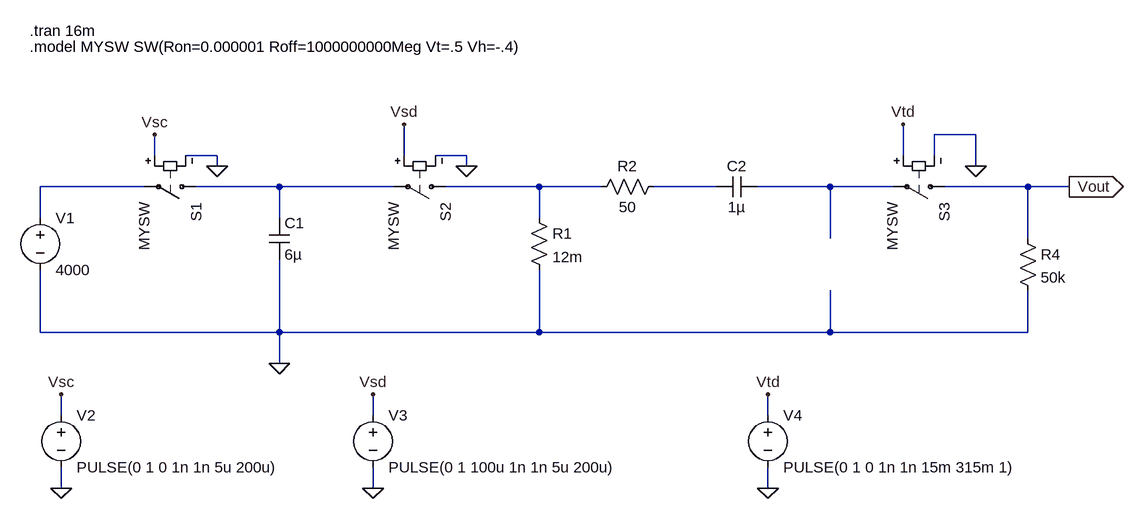
[diagram p0: schematic Draft1.asc]
Draft1.asc, the LTspice schematic file:
Version 4
SHEET 1 1632 680
WIRE 1376 0 1312 0
WIRE 112 32 112 0
WIRE 208 32 160 32
WIRE 496 32 496 -16
WIRE 592 32 544 32
WIRE 1264 32 1264 -16
WIRE 1312 32 1312 0
WIRE 208 48 208 32
WIRE 592 48 592 32
WIRE 1376 48 1376 0
WIRE 96 80 -64 80
WIRE 304 80 176 80
WIRE 480 80 304 80
WIRE 704 80 560 80
WIRE 800 80 704 80
WIRE 976 80 880 80
WIRE 1152 80 1040 80
WIRE 1248 80 1152 80
WIRE 1456 80 1328 80
WIRE 1520 80 1456 80
WIRE -64 128 -64 80
WIRE 304 128 304 80
WIRE 704 128 704 80
WIRE 1152 160 1152 80
WIRE 1456 160 1456 80
WIRE -64 304 -64 208
WIRE 304 304 304 192
WIRE 304 304 -64 304
WIRE 704 304 704 208
WIRE 704 304 304 304
WIRE 1152 304 1152 240
WIRE 1152 304 704 304
WIRE 1456 304 1456 240
WIRE 1456 304 1152 304
WIRE 304 352 304 304
WIRE -32 432 -32 400
WIRE 448 432 448 400
WIRE 1056 432 1056 400
WIRE -32 544 -32 512
WIRE 448 544 448 512
WIRE 1056 544 1056 512
FLAG 112 0 Vsc
FLAG 496 -16 Vsd
FLAG 304 352 0
FLAG 208 48 0
FLAG 592 48 0
FLAG -32 400 Vsc
FLAG 448 400 Vsd
FLAG -32 544 0
FLAG 448 544 0
FLAG 1264 -16 Vtd
FLAG 1376 48 0
FLAG 1520 80 Vout
IOPIN 1520 80 Out
FLAG 1056 400 Vtd
FLAG 1056 544 0
SYMBOL voltage -64 112 R0
WINDOW 123 0 0 Left 0
WINDOW 39 0 0 Left 0
SYMATTR InstName V1
SYMATTR Value 4000
SYMBOL sw 192 80 R90
SYMATTR InstName S1
SYMATTR Value MYSW
SYMBOL sw 576 80 R90
SYMATTR InstName S2
SYMATTR Value MYSW
SYMBOL cap 288 128 R0
SYMATTR InstName C1
SYMATTR Value 6µ
SYMBOL res 688 112 R0
SYMATTR InstName R1
SYMATTR Value 12m
SYMBOL res 784 96 R270
WINDOW 0 32 56 VTop 2
WINDOW 3 0 56 VBottom 2
SYMATTR InstName R2
SYMATTR Value 50
SYMBOL cap 976 96 R270
WINDOW 0 32 32 VTop 2
WINDOW 3 0 32 VBottom 2
SYMATTR InstName C2
SYMATTR Value 1µ
SYMBOL voltage -32 416 R0
WINDOW 123 0 0 Left 0
WINDOW 39 0 0 Left 0
SYMATTR InstName V2
SYMATTR Value PULSE(0 1 0 1n 1n 5u 200u)
SYMBOL voltage 448 416 R0
WINDOW 123 0 0 Left 0
WINDOW 39 0 0 Left 0
SYMATTR InstName V3
SYMATTR Value PULSE(0 1 100u 1n 1n 5u 200u)
SYMBOL sw 1344 80 R90
SYMATTR InstName S3
SYMATTR Value MYSW
SYMBOL res 1440 144 R0
SYMATTR InstName R4
SYMATTR Value 50k
SYMBOL voltage 1056 416 R0
WINDOW 123 0 0 Left 0
WINDOW 39 0 0 Left 0
SYMATTR InstName V4
SYMATTR Value PULSE(0 1 0 1n 1n 15m 315m 1)
TEXT -80 -160 Left 2 !.tran 16m
TEXT -80 -136 Left 2 !.model MYSW SW(Ron=0.000001 Roff=1000000000Meg Vt=.5 Vh=-.4)

The netlist it stands for:
* Draft1.asc
V1 N001 0 4000
S1 N002 N001 Vsc 0 MYSW
S2 N003 N002 Vsd 0 MYSW
C1 N002 0 6µ
R1 N003 0 12m
R2 N003 N004 50
C2 N004 N005 1µ
V2 Vsc 0 PULSE(0 1 0 1n 1n 5u 200u)
V3 Vsd 0 PULSE(0 1 100u 1n 1n 5u 200u)
S3 Vout N005 Vtd 0 MYSW
R4 Vout 0 50k
V4 Vtd 0 PULSE(0 1 0 1n 1n 15m 315m 1)
.tran 16m
.model MYSW SW(Ron=0.000001 Roff=1000000000Meg Vt=.5 Vh=-.4)
.backanno
.end